# Altium schematic sheet CW308T_CC2538_Micro.SchDoc: Main Microcontroller
size Letter; Organization: NewAE Technology Inc.; Address1: 1083 Queen St., Suite 196; Address2: Halifax; Address3: NS; Address4: Canada B3H 0B2; SheetApproved: NO
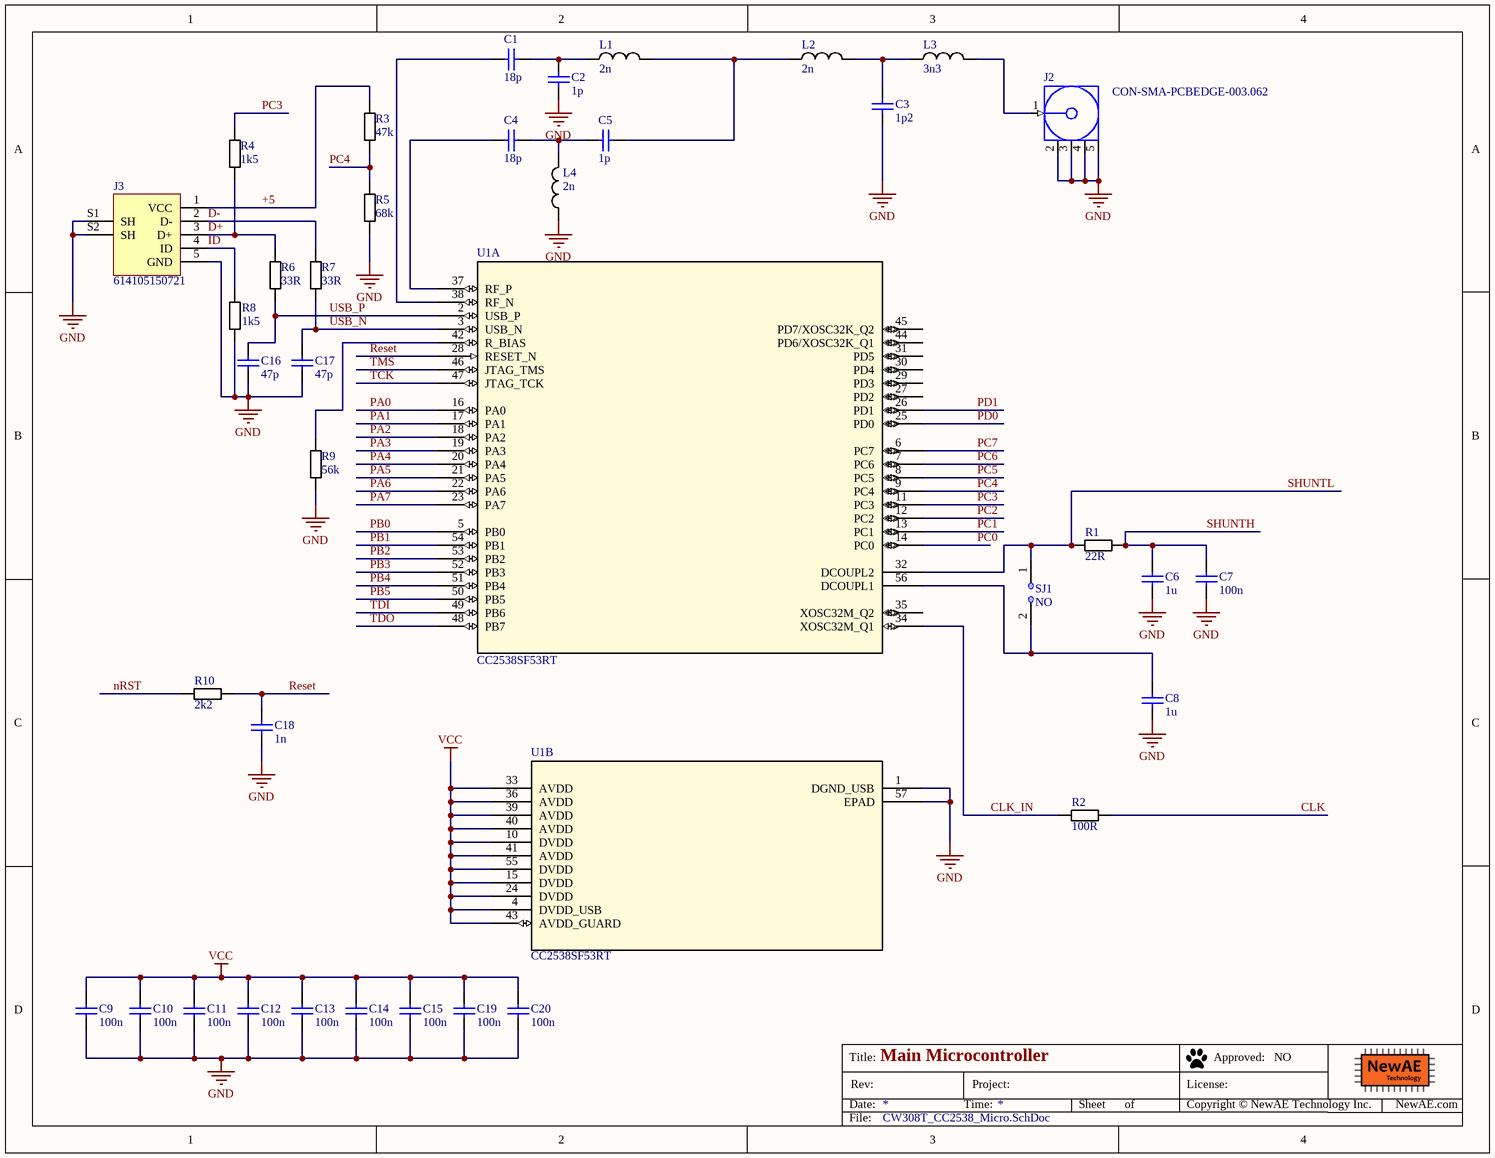
[diagram p0: CW308T_CC2538_Micro.SchDoc]

## Parts
C1  18p  [CAPC0402_M]
C2  1p  [CAPC0402_M]
C3  1p2  [CAPC0402_M]
C4  18p  [CAPC0402_M]
C5  1p  [CAPC0402_M]
C6  1u  [CAPC0603_M]
C7  100n  [CAPC0603_M]
C8  1u  [CAPC0603_M]
C9  100n  [CAPC0603_M]
C10  100n  [CAPC0603_M]
C11  100n  [CAPC0603_M]
C12  100n  [CAPC0603_M]
C13  100n  [CAPC0603_M]
C14  100n  [CAPC0603_M]
C15  100n  [CAPC0603_M]
C16  47p  [CAPC0603_M]
C17  47p  [CAPC0603_M]
C18  1n  [CAPC0603_M]
C19  100n  [CAPC0603_M]
C20  100n  [CAPC0603_M]
J2  CON-SMA-PCBEDGE-003.062  [CON-SMAM-PCB-EDGE062]
J3  614105150721  [614105150721]
L1  2n  [RESC1005X40N]
L2  2n  [RESC1005X40N]
L3  3n3  [RESC1005X40N]
L4  2n  [RESC1005X40N]
R1  22R  [RESC1608X55N]
R2  100R  [RESC1608X55N]
R3  47k  [RESC1608X55N]
R4  1k5  [RESC1608X55N]
R5  68k  [RESC1608X55N]
R6  33R  [RESC1608X55N]
R7  33R  [RESC1608X55N]
R8  1k5  [RESC1608X55N]
R9  56k  [RESC1608X55N]
R10  2k2  [RESC1608X55N]
SJ1  NO  [SJ_2S_NO]  (no BOM)
U1  CC2538SF53RT  [QFN50P800X800X100_HS-57M]  (parts A,B of 2)

## Nets
GND: C2.1 C3.2 C6.2 C7.2 C8.2 C9.2 C10.2 C11.2 C12.2 C13.2 C14.2 C15.2 C16.2 C17.2 C18.2 C19.2 C20.2 J2.2(GND) J2.3(GND) J2.4(GND) J2.5(GND) J3.5(GND) J3.S1(SH) J3.S2(SH) L4.1 R5.2 R8.2 R9.1 U1.1(DGND_USB) U1.57(EPAD)
VCC: C9.1 C10.1 C11.1 C12.1 C13.1 C14.1 C15.1 C19.1 C20.1 U1.4(DVDD_USB) U1.10(DVDD) U1.15(DVDD) U1.24(DVDD) U1.33(AVDD) U1.36(AVDD) U1.39(AVDD) U1.40(AVDD) U1.41(AVDD) U1.43(AVDD_GUARD) U1.55(DVDD)
+5: J3.1(VCC) R3.1
CLK: R2.2
CLK_IN: R2.1 U1.34(XOSC32M_Q1)
D+: J3.3(D+) R4.1 R6.2
D-: J3.2(D-) R7.1
ID: J3.4(ID) R8.1
nRST: R10.1
PA0: U1.16(PA0)
PA1: U1.17(PA1)
PA2: U1.18(PA2)
PA3: U1.19(PA3)
PA4: U1.20(PA4)
PA5: U1.21(PA5)
PA6: U1.22(PA6)
PA7: U1.23(PA7)
PB0: U1.5(PB0)
PB1: U1.54(PB1)
PB2: U1.53(PB2)
PB3: U1.52(PB3)
PB4: U1.51(PB4)
PB5: U1.50(PB5)
PC0: U1.14(PC0)
PC1: U1.13(PC1)
PC2: U1.12(PC2)
PC3: R4.2 U1.11(PC3)
PC4: R3.2 R5.1 U1.9(PC4)
PC5: U1.8(PC5)
PC6: U1.7(PC6)
PC7: U1.6(PC7)
PD0: U1.25(PD0)
PD1: U1.26(PD1)
Reset: C18.1 R10.2 U1.28(RESET_N)
SHUNTH: C6.1 C7.1 R1.2
SHUNTL: R1.1 SJ1.1 U1.32(DCOUPL2)
TCK: U1.47(JTAG_TCK)
TDI: U1.49(PB6)
TDO: U1.48(PB7)
TMS: U1.46(JTAG_TMS)
USB_N: C17.1 R7.2 U1.3(USB_N)
USB_P: C16.1 R6.1 U1.2(USB_P)
NetC1_1: C1.1 U1.38(RF_N)
NetC1_2: C1.2 C2.2 L1.1
NetC3_1: C3.1 L2.2 L3.1
NetC4_1: C4.1 U1.37(RF_P)
NetC4_2: C4.2 C5.1 L4.2
NetC5_2: C5.2 L1.2 L2.1
NetC8_1: C8.1 SJ1.2 U1.56(DCOUPL1)
NetJ2_1: J2.1(Signal) L3.2
NetR9_2: R9.2 U1.42(R_BIAS)

Not connected (* = marked no-connect by the designer): U1 27(PD2) 29(PD3) 30(PD4) 31(PD5) 35(XOSC32M_Q2) 44(PD6/XOSC32K_Q1) 45(PD7/XOSC32K_Q2)

## Notes on the sheet
- Title:
- Date:
- Rev:
- Time:
- Project:
- Sheet
- of
- License:
- Copyright © NewAE Technology Inc.
- Approved:
- NewAE.com
- File:

## Library data of the parts
C1 C4 = CCHIP-18p-0402: 18p, 0402; Manufacture Part Number 1: GRM1555C1H180JA01D; Component Group: Capacitor; Case-EIA: 0402; Part Number: CCHIP-18p-0402; Footprint: 0402; Pin Count: 2; Value: 18p; Mounting Technology: SMT; Component Kind: Standard; Component Type: Standard
C2 C5 = CCHIP-1p-0402: 1p, 0402; Manufacture Part Number 1: GRM1555C1H1R0BA01D; Component Group: Capacitor; Case-EIA: 0402; Part Number: CCHIP-1p-0402; Footprint: 0402; Pin Count: 2; Value: 1p; Mounting Technology: SMT; RoHS: Yes; Component Kind: Standard; Component Type: Standard
C3 = CCHIP-1p2-0402: 1p2, 0402; Manufacture Part Number 1: GRM1555C1H1R2CA01D; Component Group: Capacitor; Case-EIA: 0402; Part Number: CCHIP-1p2-0402; Footprint: 0402; Pin Count: 2; Value: 1p2; Mounting Technology: SMT; RoHS: Yes; Component Kind: Standard; Component Type: Standard
C6 C8 = CCHIP-1u-0603: 1u, 0603; Manufacture Part Number 1: CL10A105KB8NNNC; Component Group: Capacitor; Case-EIA: 0603; Case-Metric: 1608; Rated Voltage: 50V; Part Number: CCHIP-1u-0603; Footprint: 0603; Pin Count: 2; Value: 1u; Mounting Technology: SMT; Component Kind: Standard; Component Type: Standard; Supplier 1: Digi-Key; Supplier Part Number 1: 1276-1860-1-ND
C7 C9-C15 C19 C20 = CCHIP-100n-0603: 100n, 0603; Manufacture 1: Kemet; Manufacture Part Number 1: C0603C104K5RACTU; Component Group: Capacitor; Case-EIA: 0603; Case-Metric: 1608; Rated Voltage: 50V; Part Number: CCHIP-100n-0603; Footprint: 0603; Pin Count: 2; Value: 100n; Mounting Technology: SMT; Component Kind: Standard; Component Type: Standard; Supplier 1: Digi-Key; Supplier Part Number 1: 399-5089-2-ND
C16 C17 = CCHIP-47p-0603: 47p, 0603; Component Group: Capacitor; Case-EIA: 0603; Case-Metric: 1608; Part Number: CCHIP-47p-0603; Footprint: 0603; Pin Count: 2; Value: 47p; Mounting Technology: SMT; Component Kind: Standard; Component Type: Standard
C18 = CCHIP-1n-0603: 1n, 0603; Manufacture 1: Kemet; Component Group: Capacitor; Case-EIA: 0603; Case-Metric: 1608; Rated Voltage: 50V; Part Number: CCHIP-1n-0603; Footprint: 0603; Pin Count: 2; Supplier 1: Digi-Key; Value: 1n; Mounting Technology: SMT; Component Kind: Standard; Component Type: Standard
J2 = CON-SMA-PCBEDGE-003.062: SMA Female Edge Mount Connector for 0.062" Thick Board; PCB_Layout: Pads complies with manufacturer's recommendation.; DatasheetVersion: rev1.0, Aug-2006; PackageVersion: rev1.0, Aug-2006; PackageReference: CON-SMA-EDGE062; PackageDescription: SMA Female Edge Mount Connector for 0.062" Thick Board, 7.9 mm Body Dia.; ComponentLink1Description: Manufacturer URL; ComponentLink1URL: http://www.linxtechnologies.com/; ComponentLink2Description: Datasheet; ComponentLink2URL: http://www.connectorcity.com/diagrams/SMA/CONSMA003.062.pdf; Part Number: CON-SMA-PCBEDGE-003.062; Component Group: Connector; Pin Count: 5; Component Kind: Standard; Component Type: Standard
J3 = 614105150721: USB, 5-pin, Upright; Manufacture 1: Wurth Electronics; Component Group: Connector; PP Material Stack: 0; Part Number: 614105150721; Manufacture Part Number 1: 614105150721; Pin Count: 7; Supplier 1: Digi-Key; Supplier Part Number 1: 732-5958-1-ND; Mounting Technology: Through-hole; RoHS: Yes; Component Kind: Standard; Component Type: Standard; PP Rotation: 0
L1 L2 L4 = LCHIP-2n-0402: 2nF, 0402; Manufacture Part Number 1: LQG15HS2N0S02D; Component Group: Inductor; Case-EIA: 0402; Part Number: LCHIP-2n-0402; Footprint: 0402; Pin Count: 2; Value: 2n; Mounting Technology: SMT; RoHS: Yes; Component Kind: Standard; Component Type: Standard
L3 = LCHIP-3n3-0402: 3.3nF, 0402; Manufacture Part Number 1: LQG15HS3N3S02D; Component Group: Inductor; Case-EIA: 0402; Part Number: LCHIP-3n3-0402; Footprint: 0402; Pin Count: 2; Value: 3n3; Mounting Technology: SMT; RoHS: Yes; Component Kind: Standard; Component Type: Standard
R1 = RCHIP-22R-0603: 22R res, 0603, 1%, 1/10W; Manufacture 1: Yageo; Manufacture Part Number 1: RC0603FR-0722RL; Component Group: Resistor; Case-EIA: 0603; Case-Metric: 1608; Rated Power: 0.1W; Rated Voltage: 75VDC; Part Number: RCHIP-22R-0603; Footprint: 0603; Pin Count: 2; Supplier 1: Digi-Key; Supplier Part Number 1: 311-22.0HRCT-ND; Value: 22R; Tolerance: 1%; Mounting Technology: SMT; Temperature Range: -55C to 155C; Component Kind: Standard; Component Type: Standard
R2 = RCHIP-100R-0603: 100R res, 0603, 1%, 1/10W; Manufacture 1: Yageo; Manufacture Part Number 1: RC0603FR-07100RL; Component Group: Resistor; Case-EIA: 0603; Case-Metric: 1608; Rated Power: 0.1W; Rated Voltage: 75VDC; Part Number: RCHIP-100R-0603; Footprint: 0603; Pin Count: 2; Supplier 1: Digi-Key; Supplier Part Number 1: 311-100HRCT-ND; Value: 100R; Tolerance: 1%; Mounting Technology: SMT; Temperature Range: -55C to 155C; Component Kind: Standard; Component Type: Standard
R3 = RCHIP-47K-0603: 47k res, 0603, 1%, 1/10W; Manufacture 1: Yageo; Manufacture Part Number 1: RC0603FR-0747KL; Component Group: Resistor; Case-EIA: 0603; Case-Metric: 1608; Rated Power: 0.1W; Rated Voltage: 75VDC; Part Number: RCHIP-47K-0603; Footprint: 0603; Pin Count: 2; Supplier 1: Digi-Key; Supplier Part Number 1: 311-47.0KHRCT-ND; Value: 47k; Tolerance: 1%; Mounting Technology: SMT; Temperature Range: -55C to 155C; Component Kind: Standard; Component Type: Standard
R4 R8 = RCHIP-1K5-0603: 1k5 res, 0603, 1%, 1/10W; Manufacture 1: Yageo; Manufacture Part Number 1: RC0603FR-071K5L; Component Group: Resistor; Case-EIA: 0603; Case-Metric: 1608; Rated Power: 0.1W; Rated Voltage: 75VDC; Part Number: RCHIP-1K5-0603; Footprint: 0603; Pin Count: 2; Supplier 1: Digi-Key; Supplier Part Number 1: 311-1.50KHRCT-ND; Value: 1k5; Tolerance: 1%; Mounting Technology: SMT; Temperature Range: -55C to 155C; Component Kind: Standard; Component Type: Standard
R5 = RCHIP-68K-0603: 68k res, 0603, 1%, 1/10W; Manufacture 1: Yageo; Manufacture Part Number 1: RC0603FR-0768KL; Component Group: Resistor; Case-EIA: 0603; Case-Metric: 1608; Rated Power: 0.1W; Rated Voltage: 75VDC; Part Number: RCHIP-68K-0603; Footprint: 0603; Pin Count: 2; Supplier 1: Digi-Key; Supplier Part Number 1: 311-68.0KHRCT-ND; Value: 68k; Tolerance: 1%; Mounting Technology: SMT; Temperature Range: -55C to 155C; Component Kind: Standard; Component Type: Standard
R6 R7 = RCHIP-33R-0603: 33R res, 0603, 1%, 1/10W; Manufacture 1: Yageo; Manufacture Part Number 1: RC0603FR-0733RL; Component Group: Resistor; Case-EIA: 0603; Case-Metric: 1608; Rated Power: 0.1W; Rated Voltage: 75VDC; Part Number: RCHIP-33R-0603; Footprint: 0603; Pin Count: 2; Supplier 1: Digi-Key; Supplier Part Number 1: 311-33.0HRCT-ND; Value: 33R; Tolerance: 1%; Mounting Technology: SMT; Temperature Range: -55C to 155C; Component Kind: Standard; Component Type: Standard
R9 = RCHIP-56K-0603: 56k res, 0603, 1%, 1/10W; Manufacture 1: Yageo; Manufacture Part Number 1: RC0603FR-0756KL; Component Group: Resistor; Case-EIA: 0603; Case-Metric: 1608; Rated Power: 0.1W; Rated Voltage: 75VDC; Part Number: RCHIP-56K-0603; Footprint: 0603; Pin Count: 2; Supplier 1: Digi-Key; Supplier Part Number 1: 311-56KHRCT-ND; Value: 56k; Tolerance: 1%; Mounting Technology: SMT; Temperature Range: -55C to 155C; Component Kind: Standard; Component Type: Standard
R10 = RCHIP-2K2-0603: 2k2 res, 0603, 1%, 1/10W; Manufacture 1: Yageo; Manufacture Part Number 1: RC0603FR-072K2L; Component Group: Resistor; Case-EIA: 0603; Case-Metric: 1608; Rated Power: 0.1W; Rated Voltage: 75VDC; Part Number: RCHIP-2K2-0603; Footprint: 0603; Pin Count: 2; Supplier 1: Digi-Key; Supplier Part Number 1: 311-2.20KHRCT-ND; Value: 2k2; Tolerance: 1%; Mounting Technology: SMT; Temperature Range: -55C to 155C; Component Kind: Standard; Component Type: Standard
SJ1 = SJ_2S_NO: Solder Jumper, NO; Component Group: PCB Feature; Part Number: SJ_2S_NO; Pin Count: 2; Mounting Technology: COPPER; Component Type: Standard (No BOM)
U1 = CC2538SF53RTQT: IC RF TXRX+MCU 802.15.4, ARM, ECC/AES/RSA; Manufacturer_Part_Number: cc2538_rtq_56; Vendor: Texas Instruments; C: Copyright (C) 2015 Accelerated Designs. All rights reserved; Component Group: Digital IC; Copyright: Copyright (C) 2015 Accelerated Designs. All rights reserved; Value: Value; Type: Type; RefDes: RefDes; Part Number: CC2538SF53RTQT; Footprint: QFN57; Manufacture 1: Texas Instruments; Manufacture Part Number 1: CC2538SF53RTQT; Pin Count: 57; Supplier 1: Digi-Key; Supplier Part Number 1: 296-35797-1-ND; Mounting Technology: SMT; RoHS: Yes; Temperature Range: -40°C ~ 125°C; Component Kind: Standard; Component Type: Standard